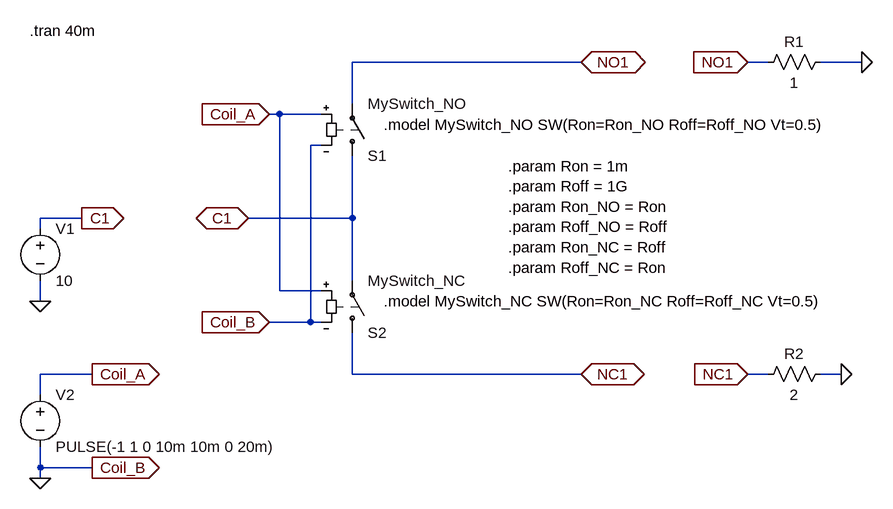
[diagram p0: schematic relay_spdt_development.asc]
relay_spdt_development.asc, the LTspice schematic file:
Version 4
SHEET 1 1304 896
WIRE 656 -80 304 -80
WIRE 944 -80 912 -80
WIRE 1088 -80 1024 -80
WIRE 304 -16 304 -80
WIRE 192 0 176 0
WIRE 256 0 192 0
WIRE 256 48 240 48
WIRE -112 160 -176 160
WIRE 304 160 304 64
WIRE 304 160 144 160
WIRE -176 176 -176 160
WIRE 304 256 304 160
WIRE 192 272 192 0
WIRE 256 272 192 272
WIRE -176 288 -176 256
WIRE 240 320 240 48
WIRE 240 320 176 320
WIRE 256 320 240 320
WIRE -96 400 -176 400
WIRE 304 400 304 336
WIRE 656 400 304 400
WIRE 944 400 912 400
WIRE 1056 400 1024 400
WIRE -176 432 -176 400
WIRE -176 544 -176 512
WIRE -96 544 -176 544
WIRE -176 560 -176 544
FLAG -176 288 0
FLAG -112 160 C1
IOPIN -112 160 Out
FLAG 912 -80 NO1
IOPIN 912 -80 In
FLAG 1088 -80 0
FLAG -96 400 Coil_A
IOPIN -96 400 Out
FLAG -96 544 Coil_B
IOPIN -96 544 Out
FLAG 912 400 NC1
IOPIN 912 400 In
FLAG 1056 400 0
FLAG -176 560 0
FLAG 656 -80 NO1
IOPIN 656 -80 BiDir
FLAG 656 400 NC1
IOPIN 656 400 BiDir
FLAG 144 160 C1
IOPIN 144 160 BiDir
FLAG 176 0 Coil_A
IOPIN 176 0 In
FLAG 176 320 Coil_B
IOPIN 176 320 In
SYMBOL voltage -176 160 R0
WINDOW 123 0 0 Left 0
WINDOW 39 0 0 Left 0
SYMATTR InstName V1
SYMATTR Value 10
SYMBOL res 928 -64 R270
WINDOW 0 32 56 VTop 2
WINDOW 3 0 56 VBottom 2
SYMATTR InstName R1
SYMATTR Value 1
SYMBOL voltage -176 416 R0
WINDOW 123 0 0 Left 0
WINDOW 39 0 0 Left 0
SYMATTR InstName V2
SYMATTR Value PULSE(-1 1 0 10m 10m 0 20m)
SYMBOL res 928 416 R270
WINDOW 0 32 56 VTop 2
WINDOW 3 0 56 VBottom 2
SYMATTR InstName R2
SYMATTR Value 2
SYMBOL sw 304 80 M180
SYMATTR InstName S1
SYMATTR Value MySwitch_NO
SYMBOL sw 304 352 M180
SYMATTR InstName S2
SYMATTR Value MySwitch_NC
TEXT -192 -128 Left 2 !.tran 40m
TEXT 544 80 Left 2 !.param Ron = 1m\n.param Roff = 1G\n.param Ron_NO = Ron\n.param Roff_NO = Roff\n.param Ron_NC = Roff\n.param Roff_NC = Ron
TEXT 352 16 Left 2 !.model MySwitch_NO SW(Ron=Ron_NO Roff=Roff_NO Vt=0.5)
TEXT 352 288 Left 2 !.model MySwitch_NC SW(Ron=Ron_NC Roff=Roff_NC Vt=0.5)

The netlist it stands for:
* relay_spdt_development.asc
V1 C1 0 10
R1 NO1 0 1
V2 Coil_A 0 PULSE(-1 1 0 10m 10m 0 20m)
R2 NC1 0 2
S1 C1 NO1 Coil_A 0 MySwitch_NO
S2 NC1 C1 Coil_A 0 MySwitch_NC
.tran 40m
.param Ron = 1m
.param Roff = 1G
.param Ron_NO = Ron
.param Roff_NO = Roff
.param Ron_NC = Roff
.param Roff_NC = Ron
.model MySwitch_NO SW(Ron=Ron_NO Roff=Roff_NO Vt=0.5)
.model MySwitch_NC SW(Ron=Ron_NC Roff=Roff_NC Vt=0.5)
.backanno
.end